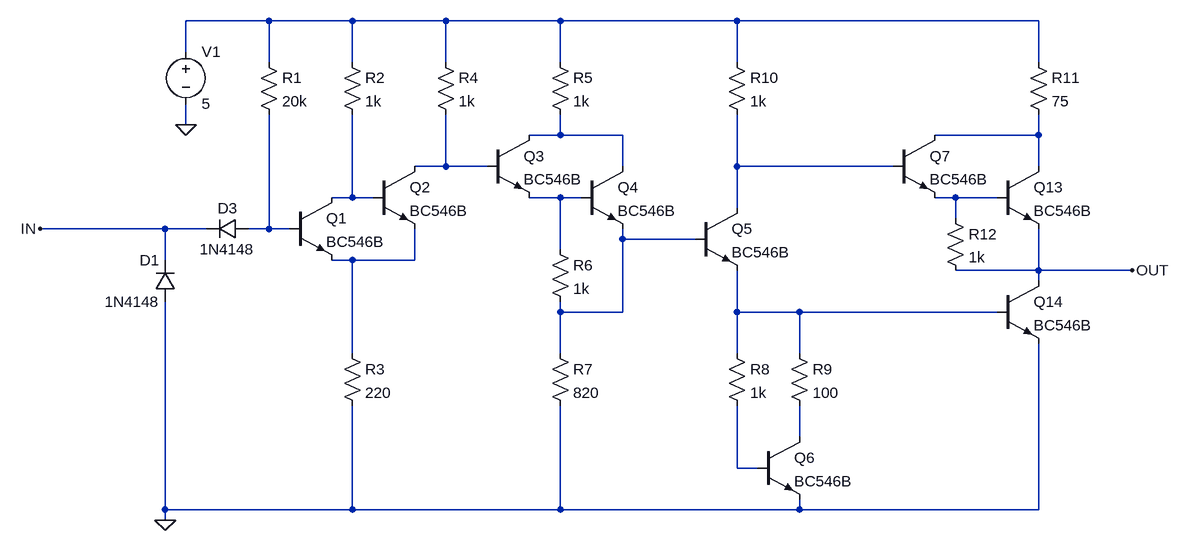
[diagram p0: schematic TTL_Schmitt_Trigger_Inverter.asc]
TTL_Schmitt_Trigger_Inverter.asc, the LTspice schematic file:
Version 4
SHEET 1 4584 1492
WIRE 560 448 432 448
WIRE 688 448 560 448
WIRE 832 448 688 448
WIRE 1008 448 832 448
WIRE 1280 448 1008 448
WIRE 1744 448 1280 448
WIRE 432 496 432 448
WIRE 560 512 560 448
WIRE 688 512 688 448
WIRE 832 512 832 448
WIRE 1008 512 1008 448
WIRE 1280 512 1280 448
WIRE 1744 512 1744 448
WIRE 432 608 432 576
WIRE 1008 624 1008 592
WIRE 1008 624 960 624
WIRE 1104 624 1008 624
WIRE 1744 624 1744 592
WIRE 1744 624 1584 624
WIRE 832 672 832 592
WIRE 832 672 784 672
WIRE 896 672 832 672
WIRE 1104 672 1104 624
WIRE 1280 672 1280 592
WIRE 1520 672 1280 672
WIRE 1744 672 1744 624
WIRE 688 720 688 592
WIRE 688 720 656 720
WIRE 720 720 688 720
WIRE 1008 720 960 720
WIRE 1040 720 1008 720
WIRE 1616 720 1584 720
WIRE 1680 720 1616 720
WIRE 1280 736 1280 672
WIRE 1616 752 1616 720
WIRE 400 768 208 768
WIRE 464 768 400 768
WIRE 560 768 560 592
WIRE 560 768 528 768
WIRE 592 768 560 768
WIRE 1104 784 1104 768
WIRE 1216 784 1104 784
WIRE 1008 800 1008 720
WIRE 400 816 400 768
WIRE 688 816 656 816
WIRE 784 816 784 768
WIRE 784 816 688 816
WIRE 1744 832 1744 768
WIRE 1744 832 1616 832
WIRE 1888 832 1744 832
WIRE 1744 848 1744 832
WIRE 1008 896 1008 880
WIRE 1104 896 1104 784
WIRE 1104 896 1008 896
WIRE 1280 896 1280 832
WIRE 1376 896 1280 896
WIRE 1680 896 1376 896
WIRE 688 960 688 816
WIRE 1008 960 1008 896
WIRE 1280 960 1280 896
WIRE 1376 960 1376 896
WIRE 1376 1088 1376 1040
WIRE 1280 1136 1280 1040
WIRE 1312 1136 1280 1136
WIRE 400 1200 400 880
WIRE 688 1200 688 1040
WIRE 688 1200 400 1200
WIRE 1008 1200 1008 1040
WIRE 1008 1200 688 1200
WIRE 1376 1200 1376 1184
WIRE 1376 1200 1008 1200
WIRE 1744 1200 1744 944
WIRE 1744 1200 1376 1200
WIRE 400 1216 400 1200
FLAG 432 608 0
FLAG 400 1216 0
FLAG 208 768 IN
FLAG 1888 832 OUT
SYMBOL voltage 432 480 R0
WINDOW 123 0 0 Left 0
WINDOW 39 0 0 Left 0
SYMATTR InstName V1
SYMATTR Value 5
SYMBOL npn 592 720 R0
SYMATTR InstName Q1
SYMATTR Value BC546B
SYMBOL npn 720 672 R0
SYMATTR InstName Q2
SYMATTR Value BC546B
SYMBOL npn 896 624 R0
SYMATTR InstName Q3
SYMATTR Value BC546B
SYMBOL npn 1040 672 R0
SYMATTR InstName Q4
SYMATTR Value BC546B
SYMBOL npn 1216 736 R0
SYMATTR InstName Q5
SYMATTR Value BC546B
SYMBOL npn 1312 1088 R0
SYMATTR InstName Q6
SYMATTR Value BC546B
SYMBOL npn 1520 624 R0
SYMATTR InstName Q7
SYMATTR Value BC546B
SYMBOL npn 1680 672 R0
SYMATTR InstName Q13
SYMATTR Value BC546B
SYMBOL npn 1680 848 R0
SYMATTR InstName Q14
SYMATTR Value BC546B
SYMBOL diode 416 880 R180
WINDOW 0 24 64 Left 2
WINDOW 3 24 0 Left 2
SYMATTR InstName D1
SYMATTR Value 1N4148
SYMBOL diode 528 752 R90
WINDOW 0 0 32 VBottom 2
WINDOW 3 32 32 VTop 2
SYMATTR InstName D3
SYMATTR Value 1N4148
SYMBOL res 544 496 R0
SYMATTR InstName R1
SYMATTR Value 20k
SYMBOL res 672 496 R0
SYMATTR InstName R2
SYMATTR Value 1k
SYMBOL res 672 944 R0
SYMATTR InstName R3
SYMATTR Value 220
SYMBOL res 816 496 R0
SYMATTR InstName R4
SYMATTR Value 1k
SYMBOL res 992 496 R0
SYMATTR InstName R5
SYMATTR Value 1k
SYMBOL res 992 784 R0
SYMATTR InstName R6
SYMATTR Value 1k
SYMBOL res 992 944 R0
SYMATTR InstName R7
SYMATTR Value 820
SYMBOL res 1264 944 R0
SYMATTR InstName R8
SYMATTR Value 1k
SYMBOL res 1360 944 R0
SYMATTR InstName R9
SYMATTR Value 100
SYMBOL res 1264 496 R0
SYMATTR InstName R10
SYMATTR Value 1k
SYMBOL res 1728 496 R0
SYMATTR InstName R11
SYMATTR Value 75
SYMBOL res 1600 736 R0
SYMATTR InstName R12
SYMATTR Value 1k

The netlist it stands for:
* TTL_Schmitt_Trigger_Inverter.asc
V1 N001 0 5
Q1 N006 N009 N011 0 BC546B
Q2 N004 N006 N011 0 BC546B
Q3 N002 N004 N007 0 BC546B
Q4 N002 N007 N010 0 BC546B
Q5 N005 N010 N012 0 BC546B
Q6 N013 N014 0 0 BC546B
Q7 N003 N005 N008 0 BC546B
Q13 N003 N008 OUT 0 BC546B
Q14 OUT N012 0 0 BC546B
D1 0 IN 1N4148
D3 N009 IN 1N4148
R1 N001 N009 20k
R2 N001 N006 1k
R3 N011 0 220
R4 N001 N004 1k
R5 N001 N002 1k
R6 N007 N010 1k
R7 N010 0 820
R8 N012 N014 1k
R9 N012 N013 100
R10 N001 N005 1k
R11 N001 N003 75
R12 N008 OUT 1k
.model D D
.lib standard.dio
.model NPN NPN
.model PNP PNP
.lib standard.bjt
.backanno
.end